# Altium schematic sheet ENC28J60.SchDoc
size A4
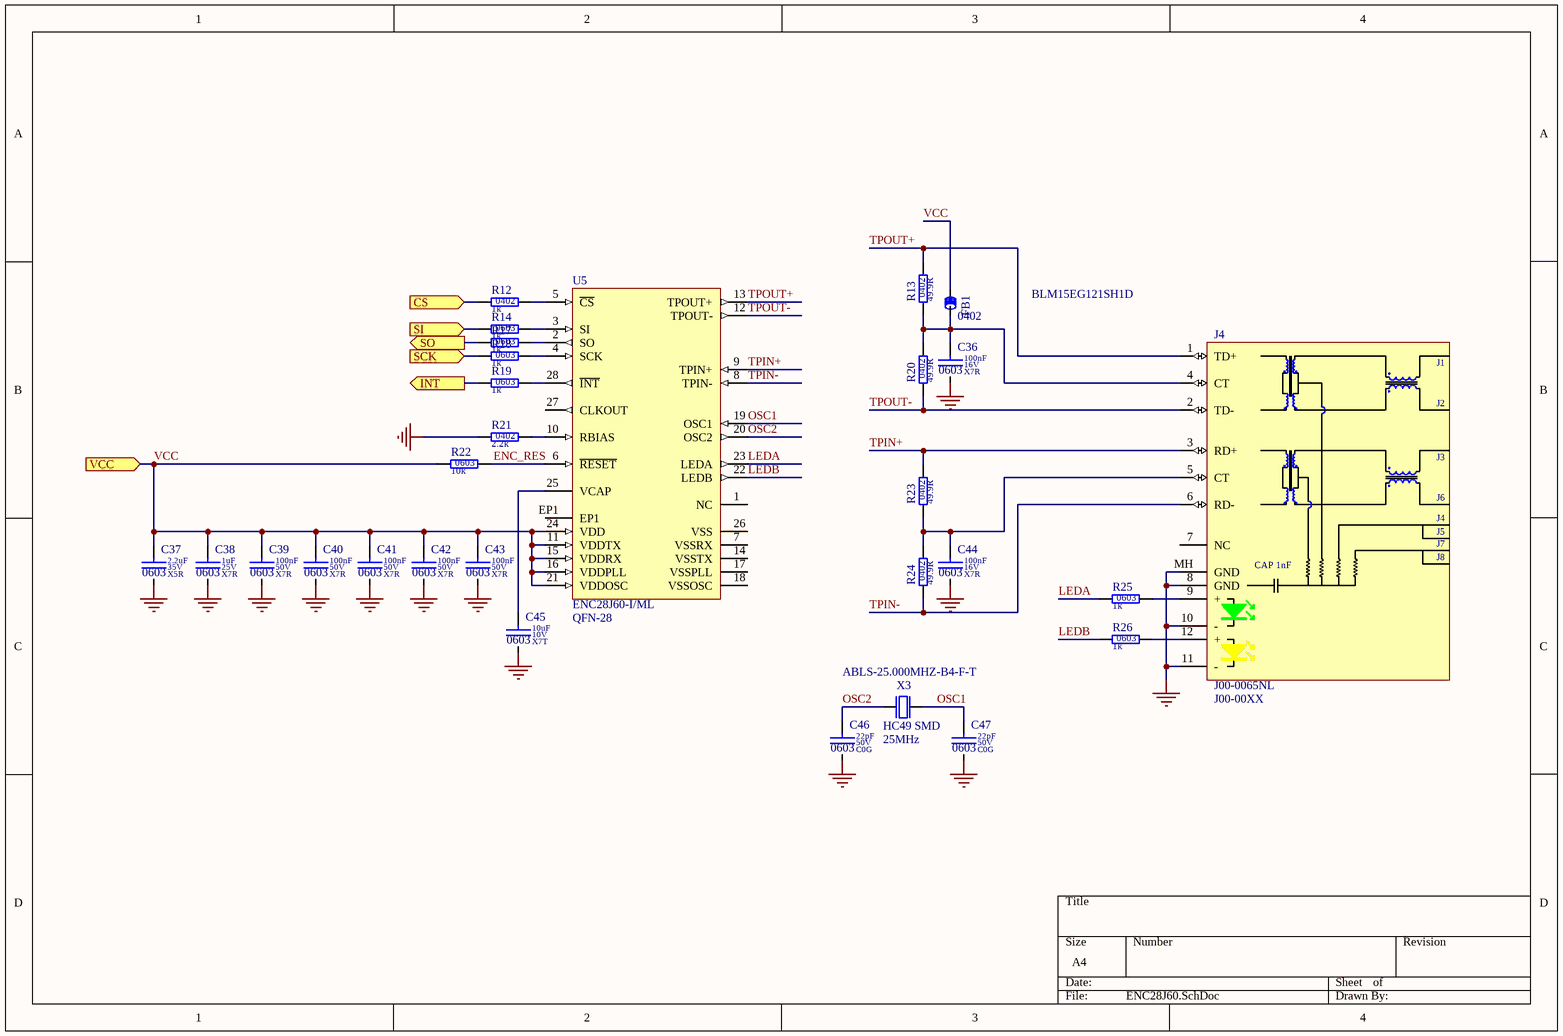
[diagram p0: ENC28J60.SchDoc]

## Parts
C36  value 100nF  Dielectric: X7R  Voltage: 16V  SCH_Footprint: 0603  [C_0603_1608]  (hidden comment: Ceramic X7R)
C37  value 2.2uF  Dielectric: X5R  Voltage: 35V  SCH_Footprint: 0603  [C_0603_1608]  (hidden comment: Ceramic X5R)
C38  value 1uF  Dielectric: X7R  Voltage: 25V  SCH_Footprint: 0603  [C_0603_1608]  (hidden comment: Ceramic X7R)
C39  value 100nF  Dielectric: X7R  Voltage: 50V  SCH_Footprint: 0603  [C_0603_1608]  (hidden comment: Ceramic X7R)
C40  value 100nF  Dielectric: X7R  Voltage: 50V  SCH_Footprint: 0603  [C_0603_1608]  (hidden comment: Ceramic X7R)
C41  value 100nF  Dielectric: X7R  Voltage: 50V  SCH_Footprint: 0603  [C_0603_1608]  (hidden comment: Ceramic X7R)
C42  value 100nF  Dielectric: X7R  Voltage: 50V  SCH_Footprint: 0603  [C_0603_1608]  (hidden comment: Ceramic X7R)
C43  value 100nF  Dielectric: X7R  Voltage: 50V  SCH_Footprint: 0603  [C_0603_1608]  (hidden comment: Ceramic X7R)
C44  value 100nF  Dielectric: X7R  Voltage: 16V  SCH_Footprint: 0603  [C_0603_1608]  (hidden comment: Ceramic X7R)
C45  value 10uF  Dielectric: X7T  Voltage: 10V  SCH_Footprint: 0603  [C_0603_1608]  (hidden comment: Ceramic X7T Low ESR and ESL)
C46  value 22pF  Dielectric: C0G  Voltage: 50V  SCH_Footprint: 0603  [C_0603_1608]  (hidden comment: Ceramic C0G)
C47  value 22pF  Dielectric: C0G  Voltage: 50V  SCH_Footprint: 0603  [C_0603_1608]  (hidden comment: Ceramic C0G)
FB1  value BLM15EG121SH1D  SCH_Footprint: 0402  [FB_0402_1005]  (hidden comment: Ferrite bead)
J4  value J00-0065NL  [J00-00XX]  (hidden comment: Modular Connectors / Ethernet Connectors 1X1 TAB DOWN 10/100)
R12  value 1k  SCH_Footprint: 0402  [R_0402_1005]  (hidden comment: Resistor)
R13  value 49.9R  SCH_Footprint: 0402  [R_0402_1005]  (hidden comment: Resistor)
R14  value 1k  SCH_Footprint: 0603  [R_0603_1608]  (hidden comment: Resistor)
R17  value 1k  SCH_Footprint: 0603  [R_0603_1608]  (hidden comment: Resistor)
R18  value 1k  SCH_Footprint: 0603  [R_0603_1608]  (hidden comment: Resistor)
R19  value 1k  SCH_Footprint: 0603  [R_0603_1608]  (hidden comment: Resistor)
R20  value 49.9R  SCH_Footprint: 0402  [R_0402_1005]  (hidden comment: Resistor)
R21  value 2.2k  SCH_Footprint: 0402  [R_0402_1005]  (hidden comment: Resistor)
R22  value 10k  SCH_Footprint: 0603  [R_0603_1608]  (hidden comment: Resistor)
R23  value 49.9R  SCH_Footprint: 0402  [R_0402_1005]  (hidden comment: Resistor)
R24  value 49.9R  SCH_Footprint: 0402  [R_0402_1005]  (hidden comment: Resistor)
R25  value 1k  SCH_Footprint: 0603  [R_0603_1608]  (hidden comment: Resistor)
R26  value 1k  SCH_Footprint: 0603  [R_0603_1608]  (hidden comment: Resistor)
U5  value ENC28J60-I/ML  SCH_Footprint: QFN-28  [QFN28_6x6_EP]  (hidden comment: Stand-Alone Ethernet Controller with SPI Interface)
X3  value 25MHz  Manufacturer Part Number: ABLS-25.000MHZ-B4-F-T  SCH_Footprint: HC49 SMD  [X_HC49_SMD]  (hidden comment: X_GENERIC)

## Ports
CS (in), INT (out), SCK (in), SI (in), SO (out), VCC (in)

## Nets
GND: C36.2 C37.2 C38.2 C39.2 C40.2 C41.2 C42.2 C43.2 C44.2 C45.2 C46.2 C47.2 J4.8(GND) J4.10(-) J4.11(-) J4.MH(GND) R21.1
CS: R12.1 ; port CS
ENC_RES: R22.2 U5.6(~{RESET})
INT: R19.1 ; port INT
LEDA: R25.1 U5.23(LEDA)
LEDB: R26.1 U5.22(LEDB)
OSC1: C47.1 U5.19(OSC1) X3.2
OSC2: C46.1 U5.20(OSC2) X3.1
SCK: R18.1 ; port SCK
SI: R14.1 ; port SI
SO: R17.1 ; port SO
TPIN+: J4.3(RD+) R23.2 U5.9(TPIN+)
TPIN-: J4.6(RD-) R24.1 U5.8(TPIN-)
TPOUT+: J4.1(TD+) R13.2 U5.13(TPOUT+)
TPOUT-: J4.2(TD-) R20.1 U5.12(TPOUT-)
VCC: C37.1 C38.1 C39.1 C40.1 C41.1 C42.1 C43.1 FB1.1 R22.1 U5.11(VDDTX) U5.15(VDDRX) U5.16(VDDPLL) U5.21(VDDOSC) U5.24(VDD) ; port VCC
NetC36_1: C36.1 FB1.2 J4.4(CT) R13.1 R20.2
NetC44_1: C44.1 J4.5(CT) R23.1 R24.2
NetC45_1: C45.1 U5.25(VCAP)
NetJ4_9: J4.9(+) R25.2
NetJ4_12: J4.12(+) R26.2
NetR12_2: R12.2 U5.5(~{CS})
NetR14_2: R14.2 U5.3(SI)
NetR17_2: R17.2 U5.2(SO)
NetR18_2: R18.2 U5.4(SCK)
NetR19_2: R19.2 U5.28(~{INT})
NetR21_2: R21.2 U5.10(RBIAS)

Not connected (* = marked no-connect by the designer): J4 7(NC); U5 1(NC) 7(VSSRX) 14(VSSTX) 17(VSSPLL) 18(VSSOSC) 26(VSS) 27(CLKOUT) EP1

## Notes on the sheet
- (in symbol J_J00-0065NL) J1; J2; J3; J6; J5; J7; J8; CAP 1nF

## Library data of the parts
C36 C44 = C_100nF_16V_X7R_0603_10: Capacitor; Manufacturer: Kemet; Manufacturer Part Number: C0603C104K4RAC7013; Tolerance (%): 10; Part Number: C_100nF_16V_X7R_0603_10; HelpURL: https://pl.mouser.com/datasheet/2/212/KEM_C1002_X7R_SMD-1102033.pdf; Supplier 1: TME; Supplier 2: RS Components; Supplier 3: Farnell; Supplier 4: Mouser; Supplier Part Number 4: 80-C0603C104K4RC7013; Supplier 5: Digi-Key; Supplier Part Number 5: 399-7372-2-ND; Supplier 6: LCSC
C37 = C_2.2uF_35V_X5R_0603_10: Capacitor; Manufacturer: Murata; Manufacturer Part Number: GRM188R6YA225KA12D; Tolerance (%): 10; Part Number: C_2.2uF_35V_X5R_0603_10; HelpURL: https://datasheet.octopart.com/GRM188R6YA225KA12D-Murata-datasheet-66077095.pdf; Supplier 1: TME; Supplier 2: RS Components; Supplier Part Number 2: 8151358; Supplier 3: Farnell; Supplier Part Number 3: 2611926; Supplier 4: Mouser; Supplier Part Number 4: 81-GRM188R6YA225KA2D; Supplier 5: Digi-Key; Supplier Part Number 5: 490-7204-1-ND; Supplier 6: LCSC
C38 = C_1uF_25V_X7R_0603_10: Capacitor; Manufacturer: Samsung; Manufacturer Part Number: CL10B105KA8NNNC; Tolerance (%): 10; Part Number: C_1uF_25V_X7R_0603_10; HelpURL: http://www.tme.eu/pl/Document/4a42202b32dab16128fe107dd69598cc/samsung-chip-cap.pdf; Supplier 1: TME; Supplier Part Number 1: CL10B105KA8NNNC; Supplier 2: RS Components; Supplier 3: Farnell; Supplier 4: Mouser; Supplier 5: Digi-Key; Supplier 6: LCSC
C39-C43 = C_100nF_50V_X7R_0603_5: Capacitor; Manufacturer: Samsung; Manufacturer Part Number: CL10B104JB8NNNC; Tolerance (%): 5; Part Number: C_100nF_50V_X7R_0603_5; HelpURL: http://www.tme.eu/pl/Document/4a42202b32dab16128fe107dd69598cc/samsung-chip-cap.pdf; Supplier 1: TME; Supplier Part Number 1: CL10B104JB8NNNC; Supplier 2: RS Components; Supplier Part Number 2: 7665455; Supplier 3: Farnell; Supplier 4: Mouser; Supplier 5: Digi-Key; Supplier Part Number 5: 1276-1033-1-ND; Supplier 6: LCSC; Supplier Part Number 6: C24452
C45 = C_10uF_10V_X7T_0603_20: Capacitor; Manufacturer: Murata; Manufacturer Part Number: GRM188D71A106MA73D; Tolerance (%): 20; Part Number: C_10uF_10V_X7T_0603_20; HelpURL: https://pl.mouser.com/datasheet/2/281/murata_03052018_GRM_Series_1-1310166.pdf; Supplier 1: TME; Supplier 2: RS Components; Supplier Part Number 2: 8151349; Supplier 3: Farnell; Supplier Part Number 3: 2611920; Supplier 4: Mouser; Supplier Part Number 4: 81-GRM188D71A106MA3D; Supplier 5: Digi-Key; Supplier Part Number 5: 490-7200-1-ND; Supplier 6: LCSC; Supplier Part Number 6: C162270
C46 C47 = C_22pF_50V_C0G_0603_5: Capacitor; Manufacturer: Yageo; Manufacturer Part Number: CC0603JRNPO9BN220; Tolerance (%): 5; Part Number: C_22pF_50V_C0G_0603_5; HelpURL: https://datasheet.octopart.com/CC0603JRNPO9BN220-Yageo-datasheet-136957424.pdf; Supplier 1: TME; Supplier Part Number 1: CC0603JRNPO9220; Supplier 2: RS Components; Supplier 3: Farnell; Supplier Part Number 3: 722005; Supplier 4: Mouser; Supplier Part Number 4: 603-CC603JRNPO9BN220; Supplier 5: Digi-Key; Supplier Part Number 5: 311-1062-1-ND; Supplier 6: LCSC
FB1 = FB_BLM15EG121SH1D: Manufacturer: Murata; Current: 1.5A; Resistance: 95mR; Part Number: FB_BLM15EG121SH1D; HelpURL: http://datasheet.octopart.com/BLM15EG121SH1D-Murata-datasheet-37129980.pdf; Manufacturer Part Number: BLM15EG121SH1D; Supplier 1: TME; Supplier 2: RS Components; Supplier 3: Farnell; Supplier Part Number 3: 2871614; Supplier 4: Mouser; Supplier Part Number 4: 81-BLM15EG121SH1D; Supplier 5: Digi-Key; Supplier Part Number 5: 490-17344-1-ND; Supplier 6: LCSC
J4 = J_J00-0065NL: Manufacturer: Pulse; SCH_Footprint: J00-00XX; Part Number: J_J00-0065NL; HelpURL: https://datasheet.octopart.com/J00-0065NL-Pulse-datasheet-7613.pdf; Manufacturer Part Number: J00-0065NL; Supplier 1: TME; Supplier 2: RS Components; Supplier 3: Farnell; Supplier Part Number 3: 2896134; Supplier 4: Mouser; Supplier Part Number 4: 673-J00-0065NL; Supplier 5: Digi-Key; Supplier Part Number 5: 553-1345-ND; Supplier 6: LCSC
R12 = R_1k_0402_1: Manufacturer: Yageo; Manufacturer Part Number: RC0402FR-071K; Voltage: 50V; Power: 63mW; Tolerance: 1%; Part Number: R_1k_0402_1; HelpURL: http://www.tme.eu/pl/Document/1a2bc76e2be68b3b1670068306778ce6/rc0402yageo.pdf; Supplier 1: TME; Supplier Part Number 1: RC0402FR-071K; Supplier 2: RS Components; Supplier 3: Farnell; Supplier Part Number 3: 9239235; Supplier 4: Mouser; Supplier Part Number 4: 603-RC0402FR-071KP; Supplier 5: Digi-Key; Supplier Part Number 5: 311-1.00KLRCT-ND; Supplier 6: LCSC
R13 R20 R23 R24 = R_49.9R_0402_1: Manufacturer: Panasonic; Manufacturer Part Number: ERJ-2RKF49R9X; Voltage: 50V; Power: 100mW; Tolerance: 1%; Part Number: R_49.9R_0402_1; HelpURL: https://datasheet.octopart.com/ERJ-2RKF49R9X-Panasonic-datasheet-13266541.pdf; Supplier 1: TME; Supplier 2: RS Components; Supplier Part Number 2: 812-6611; Supplier 3: Farnell; Supplier Part Number 3: 2059109; Supplier 4: Mouser; Supplier Part Number 4: 667-ERJ-2RKF49R9X; Supplier 5: Digi-Key; Supplier Part Number 5: P49.9LCT-ND; Supplier 6: LCSC
R14 R17-R19 R25 R26 = R_1k_0603_1: Manufacturer: Vishay; Manufacturer Part Number: CRCW06031K00FKEA; Voltage: 75V; Power: 100mW; Tolerance: 1%; Part Number: R_1k_0603_1; HelpURL: http://www.farnell.com/datasheets/2310790.pdf?_ga=2.256888843.1690599162.1548417389-1379097396.1542296996&_gac=1.262631934.1547230258.Cj0KCQiAmuHhBRD0ARIsAFWyPwhX8HcvXnM3tA0ZBodZLzDIjH2ZxLpjT5LWo9bad_HPRbU8LfPq44UaAhEwEALw_wcB; Supplier 1: TME; Supplier 2: RS Components; Supplier Part Number 2: 678-9875P; Supplier 3: Farnell; Supplier Part Number 3: 1469740; Supplier 4: Mouser; Supplier Part Number 4: 71-CRCW0603-1.0K-E3; Supplier 5: Digi-Key; Supplier Part Number 5: 541-1.00KHCT-ND; Supplier 6: LCSC
R21 = R_2.2k_0402_1: Manufacturer: Panasonic; Manufacturer Part Number: ERJ-2RKF2201X; Voltage: 50V; Power: 100mW; Tolerance: 1%; Part Number: R_2.2k_0402_1; HelpURL: https://datasheet.octopart.com/ERJ-2RKF2201X-Panasonic-datasheet-13266541.pdf; Supplier 1: TME; Supplier 2: RS Components; Supplier Part Number 2: 7325384; Supplier 3: Farnell; Supplier Part Number 3: 2397219; Supplier 4: Mouser; Supplier Part Number 4: ERJ-2RKF2201X; Supplier 5: Digi-Key; Supplier Part Number 5: P2.20KLCT-ND; Supplier 6: LCSC
R22 = R_10k_0603_1: Manufacturer: Vishay; Manufacturer Part Number: CRCW060310K0FKTABC; Voltage: 75V; Power: 100mW; Tolerance: 1%; Part Number: R_10k_0603_1; HelpURL: http://www.tme.eu/pl/Document/622e28308c06d160637f2b14751ba16b/Data%20Sheet%20CRCW_BCe3.pdf; Supplier 1: TME; Supplier Part Number 1: CRCW060310K0FKTABC; Supplier 2: RS Components; Supplier 3: Farnell; Supplier 4: Mouser; Supplier Part Number 4: 667-ERJ-3EKF1002V; Supplier 5: Digi-Key; Supplier Part Number 5: P10KGCT-ND; Supplier 6: LCSC
U5 = U_ENC28J60-I/ML: Series 3.3 V Stand-Alone Ethernet Controller with SPI Interface; Manufacturer: Microchip; Part Number: U_ENC28J60-I/ML; HelpURL: https://datasheet.octopart.com/ENC28J60-I/ML-Microchip-datasheet-5428630.pdf; Manufacturer Part Number: ENC28J60-I/ML; Supplier 1: TME; Supplier Part Number 1: ENC28J60-I/ML; Supplier 2: RS Components; Supplier Part Number 2: 6665710; Supplier 3: Farnell; Supplier Part Number 3: 1564400; Supplier 4: Mouser; Supplier Part Number 4: 579-ENC28J60-I/ML; Supplier 5: Digi-Key; Supplier Part Number 5: ENC28J60-I/ML-ND; Supplier 6: LCSC; Supplier Part Number 6: C57281
X3 = ABLS-25.000MHZ-B4-F-T: Resonator Ceramic; Manufacturer: Abracon; Part Number: ABLS-25.000MHZ-B4-F-T; HelpURL: https://datasheet.octopart.com/ABLS-25.000MHZ-B4-F-T-Abracon-datasheet-37142362.pdf; Supplier 1: TME; Supplier 2: RS Components; Supplier 3: Farnell; Supplier 4: Mouser; Supplier 5: Digi-Key; Supplier 6: LCSC